# EAGLE design AgitPOV_WiFi (EAGLE 7.4.0)
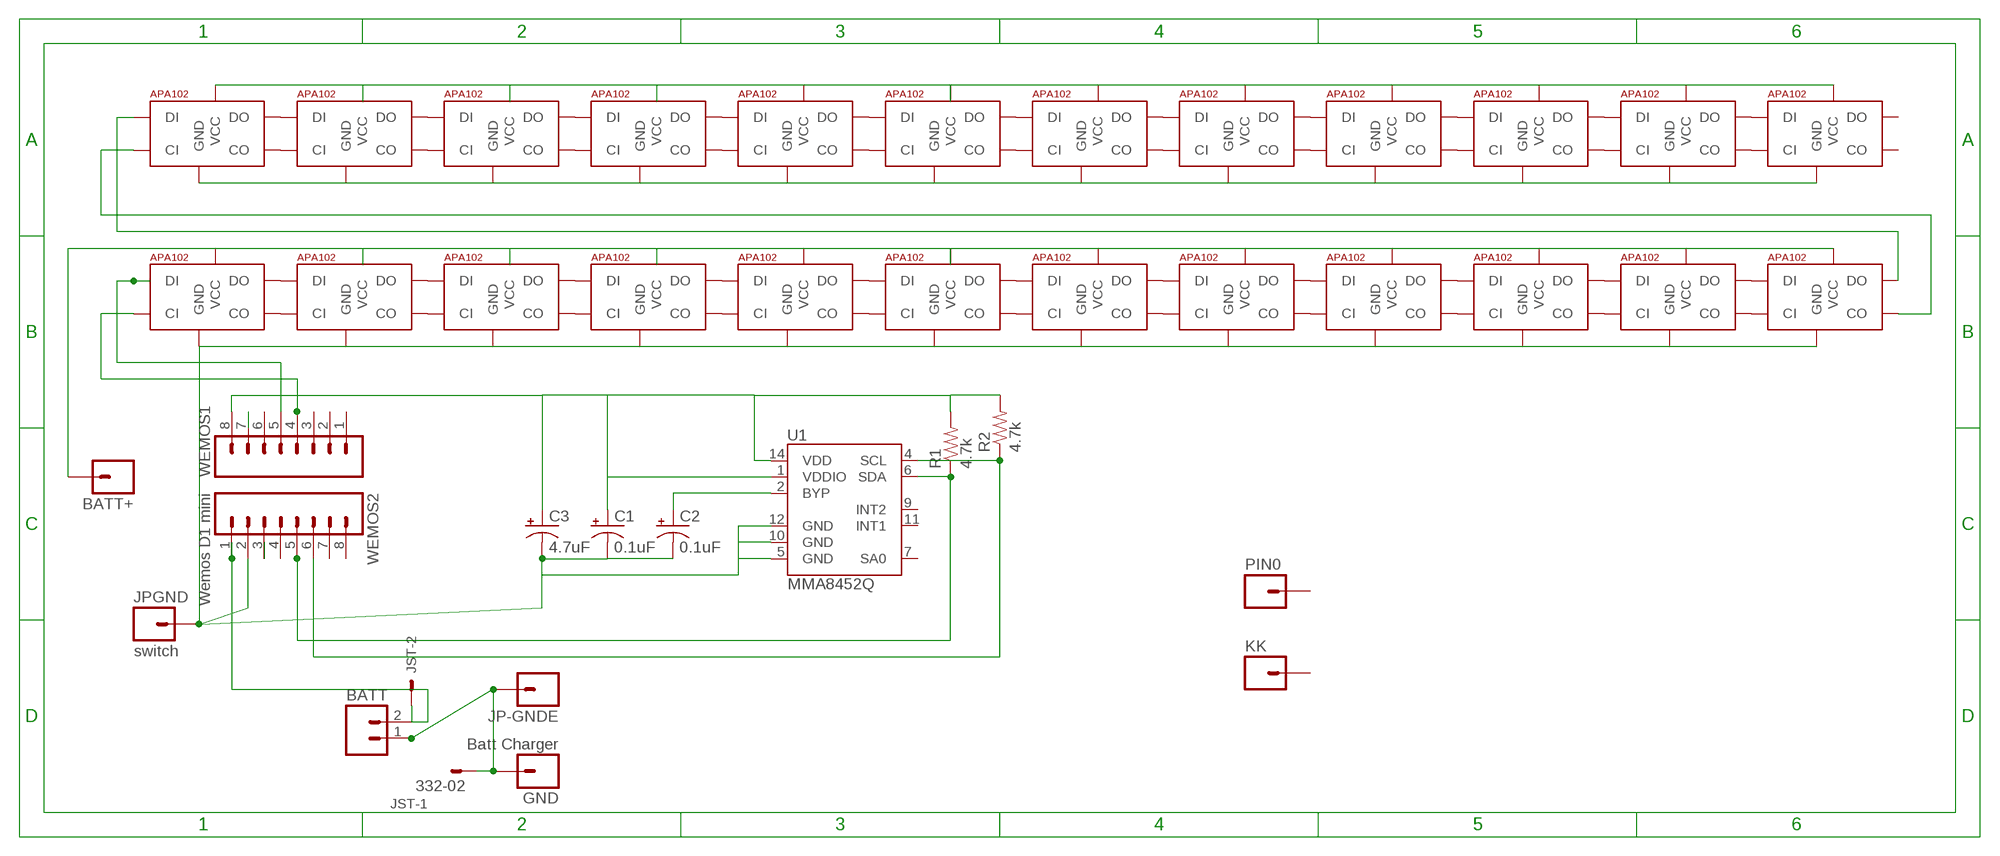
[diagram p0: schematic, sheet 1]

## Parts
BATT  M02LOCK_LONGPADS  [1X02_LOCK_LONGPADS]
BATT+  M01PTH  [1X01]
C1  0.1uF  10UF-16V-10%(TANT)  [EIA3216]
C2  0.1uF  10UF-16V-10%(TANT)  [EIA3216]
C3  4.7uF  10UF-16V-10%(TANT)  [EIA3216]
DEL1  APA1025050  [APA102_5050]
DEL2  APA1025050  [APA102_5050]
DEL3  APA1025050  [APA102_5050]
DEL4  APA1025050  [APA102_5050]
DEL5  APA1025050  [APA102_5050]
DEL6  APA1025050  [APA102_5050]
DEL7  APA1025050  [APA102_5050]
DEL8  APA1025050  [APA102_5050]
DEL9  APA1025050  [APA102_5050]
DEL10  APA1025050  [APA102_5050]
DEL11  APA1025050  [APA102_5050]
DEL12  APA1025050  [APA102_5050]
DEL13  APA1025050  [APA102_5050]
DEL15  APA1025050  [APA102_5050]
DEL16  APA1025050  [APA102_5050]
DEL17  APA1025050  [APA102_5050]
DEL18  APA1025050  [APA102_5050]
DEL19  APA1025050  [APA102_5050]
DEL20  APA1025050  [APA102_5050]
DEL21  APA1025050  [APA102_5050]
DEL22  APA1025050  [APA102_5050]
DEL23  APA1025050  [APA102_5050]
DEL24  APA1025050  [APA102_5050]
FFFFF  APA1025050  [APA102_5050]
GND  Batt Charger  M01PTH  [1X01]
JP-GNDE  M01PTH  [1X01]
JPGND  switch  M01PTH  [1X01]
JST  332-02  [332-02]
KK  M01PTH  [1X01]
PIN0  M01PTH  [1X01]
R1  4.7k  RESISTOR1206  [1206]
R2  4.7k  RESISTOR1206  [1206]
U1  MMA8452Q  [QFN-16_0.5MM]
WEMOS1  M08  [1X08_ROUND]
WEMOS2  Wemos D1 mini  M08  [1X08_ROUND]

## Nets
5V: BATT+.1 BATT.2 DEL1.1(VCC) DEL2.1(VCC) DEL3.1(VCC) DEL4.1(VCC) DEL5.1(VCC) DEL6.1(VCC) DEL7.1(VCC) DEL8.1(VCC) DEL9.1(VCC) DEL10.1(VCC) DEL11.1(VCC) DEL12.1(VCC) DEL13.1(VCC) DEL15.1(VCC) DEL16.1(VCC) DEL17.1(VCC) DEL18.1(VCC) DEL19.1(VCC) DEL20.1(VCC) DEL21.1(VCC) DEL22.1(VCC) DEL23.1(VCC) DEL24.1(VCC) FFFFF.1(VCC) JST.2 WEMOS2.1
+3.3V: C1.A(+) C3.A(+) R1.2 R2.2 U1.1(VDDIO) U1.14(VDD) WEMOS1.8
BYP: C2.A(+) U1.2(BYP)
ENTREEGND: BATT.1 GND.1 JP-GNDE.1 JST.1
GND: C1.C(-) C2.C(-) C3.C(-) DEL1.6(GND) DEL2.6(GND) DEL3.6(GND) DEL4.6(GND) DEL5.6(GND) DEL6.6(GND) DEL7.6(GND) DEL8.6(GND) DEL9.6(GND) DEL10.6(GND) DEL11.6(GND) DEL12.6(GND) DEL13.6(GND) DEL15.6(GND) DEL16.6(GND) DEL17.6(GND) DEL18.6(GND) DEL19.6(GND) DEL20.6(GND) DEL21.6(GND) DEL22.6(GND) DEL23.6(GND) DEL24.6(GND) FFFFF.6(GND) JPGND.1 U1.5(GND) U1.10(GND) U1.12(GND) WEMOS2.2
N$1: WEMOS1.7
N$2: DEL1.5(CI) WEMOS1.4
N$4: DEL1.4(DI) WEMOS1.5
N$8: DEL12.2(CO) DEL13.5(CI)
N$12: DEL2.2(CO) DEL3.5(CI)
N$14: DEL2.3(DO) DEL3.4(DI)
N$15: DEL1.3(DO) DEL2.4(DI)
N$16: DEL1.2(CO) DEL2.5(CI)
N$17: DEL3.3(DO) DEL4.4(DI)
N$18: DEL3.2(CO) DEL4.5(CI)
N$19: DEL4.3(DO) DEL5.4(DI)
N$20: DEL4.2(CO) DEL5.5(CI)
N$21: DEL5.3(DO) DEL6.4(DI)
N$22: DEL5.2(CO) DEL6.5(CI)
N$23: DEL6.3(DO) DEL7.4(DI)
N$24: DEL6.2(CO) DEL7.5(CI)
N$25: DEL7.3(DO) DEL8.4(DI)
N$26: DEL7.2(CO) DEL8.5(CI)
N$27: DEL8.3(DO) DEL9.4(DI)
N$28: DEL8.2(CO) DEL9.5(CI)
N$29: DEL9.3(DO) DEL10.4(DI)
N$30: DEL9.2(CO) DEL10.5(CI)
N$31: DEL10.3(DO) DEL11.4(DI)
N$32: DEL10.2(CO) DEL11.5(CI)
N$33: DEL11.3(DO) DEL12.4(DI)
N$34: DEL11.2(CO) DEL12.5(CI)
N$41: WEMOS2.3
N$42: DEL12.3(DO) DEL13.4(DI)
N$43: DEL15.5(CI) FFFFF.2(CO)
N$44: DEL15.4(DI) FFFFF.3(DO)
N$45: DEL13.3(DO) FFFFF.4(DI)
N$46: DEL13.2(CO) FFFFF.5(CI)
N$47: DEL15.3(DO) DEL16.4(DI)
N$48: DEL15.2(CO) DEL16.5(CI)
N$49: DEL16.3(DO) DEL17.4(DI)
N$50: DEL16.2(CO) DEL17.5(CI)
N$51: DEL17.3(DO) DEL18.4(DI)
N$52: DEL17.2(CO) DEL18.5(CI)
N$53: DEL18.3(DO) DEL19.4(DI)
N$54: DEL18.2(CO) DEL19.5(CI)
N$55: DEL19.3(DO) DEL20.4(DI)
N$56: DEL19.2(CO) DEL20.5(CI)
N$57: DEL20.3(DO) DEL21.4(DI)
N$58: DEL20.2(CO) DEL21.5(CI)
N$59: DEL21.3(DO) DEL22.4(DI)
N$60: DEL21.2(CO) DEL22.5(CI)
N$61: DEL22.3(DO) DEL23.4(DI)
N$62: DEL22.2(CO) DEL23.5(CI)
N$63: DEL23.3(DO) DEL24.4(DI)
N$64: DEL23.2(CO) DEL24.5(CI)
SCL: R2.1 U1.4(SCL) WEMOS2.6
SDA: R1.1 U1.6(SDA) WEMOS2.5
Unconnected: DEL24.2(CO) DEL24.3(DO) KK.1 PIN0.1 U1.7(SA0) U1.9(INT2) U1.11(INT1) WEMOS1.1 WEMOS1.2 WEMOS1.3 WEMOS1.6 WEMOS2.4 WEMOS2.7 WEMOS2.8

## Library data of the parts
BATT = SparkFun-Connectors:M02: Standard 2-pin 0.1" header. Use with - straight break away headers ( PRT-00116) - right angle break away headers (PRT-00553) - swiss pins (PRT-00743) - machine pins (PRT-00117) - female headers (PRT-00115) Molex polarized connector foot print use with: PRT-08233 with associated crimp pins and housings. 2.54_SCREWTERM for use with PRT-10571. 3.5mm Screw Terminal footprints for PRT-08084 5mm Screw Terminal footprints for use with PRT-08432
BATT+ GND JP-GNDE JPGND KK PIN0 = SparkFun-Connectors:M01: Header 1 Standard 1-pin 0.1" header. Use with straight break away headers (SKU : PRT-00116), right angle break away headers (PRT-00553), swiss pins (PRT-00743), machine pins (PRT-00117), and female headers (PRT-00115).
C1-C3 = SparkFun-Capacitors:10UF-16V-10%(TANT): CAP-00811 1206/EIA-3216 Tantalum capacitor; PROD_ID: CAP-00811; VALUE: 10uF
DEL1-DEL13 DEL15-DEL24 FFFFF = jos-ph:APA102: APA102C 5050 RGB LED -- Adafruit DotStar Single LED Pixel Product Page: https://www.adafruit.com/products/2343 Datasheet: https://cdn-shop.adafruit.com/product-files/2343/APA102C.pdf
JST = con-garry:332-02: 2 Pin - 2mm Dual Row Source: www.mpe-connector.de / garry_shortform_2012.pdf
R1 R2 = SparkFun-Resistors:RESISTOR: Resistor Basic schematic elements and footprints for 0603, 1206, and PTH resistors.
U1 = SparkFun-Sensors:MMA8452Q: MMA8452Q 3-Axis, 12/8-bit Digital Accelerometer Supply Voltage: 1.6-3.6V Range: +/- 2g, 4g, 8g Interface: I2C, 12-bit and 8-bit ODR: 1.56 Hz - 800 Hz Package: QFN-16 http://cache.freescale.com/files/sensors/doc/data_sheet/MMA8452Q.pdf; PROD_ID: IC-10769
WEMOS1 WEMOS2 = SparkFun-Connectors:M08: Header 8 Standard 8-pin 0.1" header. Use with straight break away headers (SKU : PRT-00116), right angle break away headers (PRT-00553), swiss pins (PRT-00743), machine pins (PRT-00117), and female headers (PRT-00115).

## Board
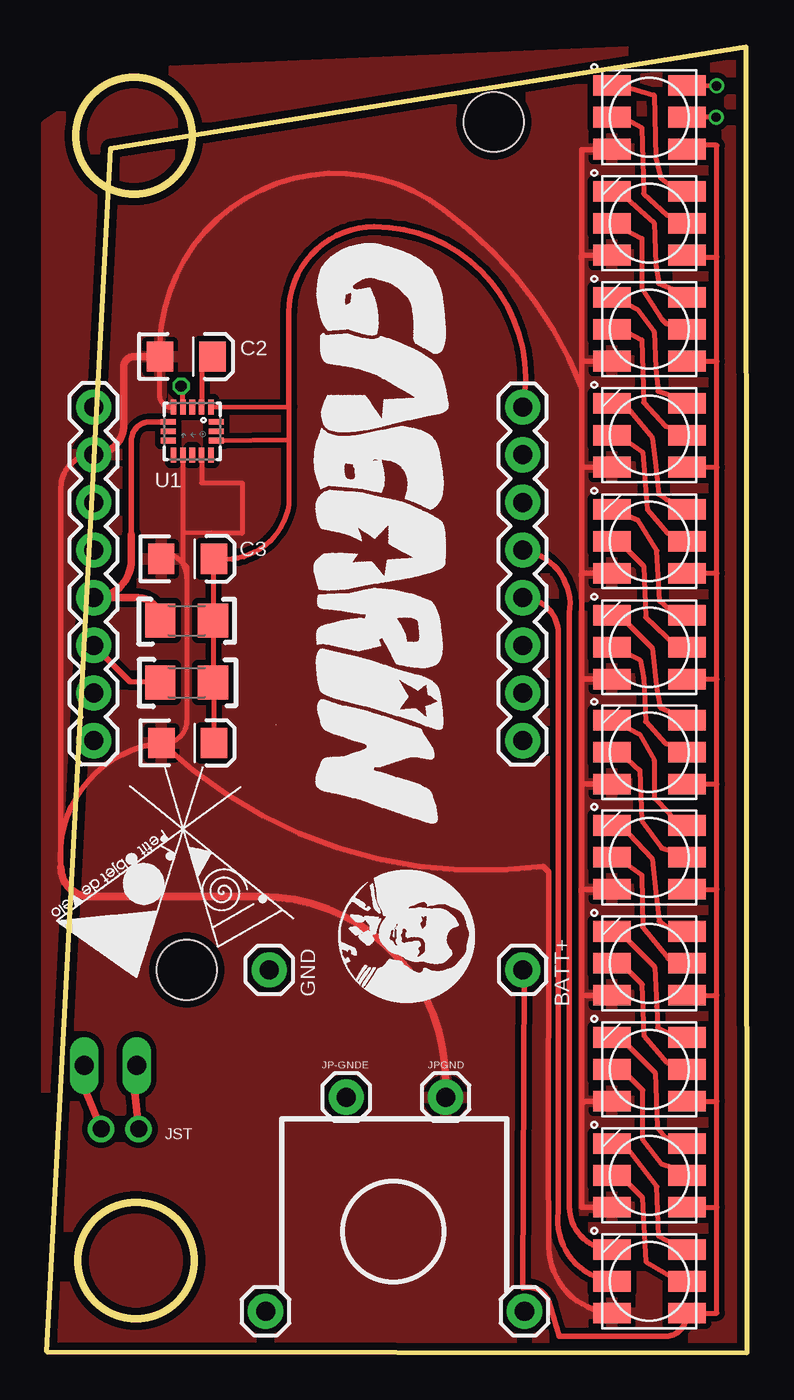
[diagram p1: board, top side]
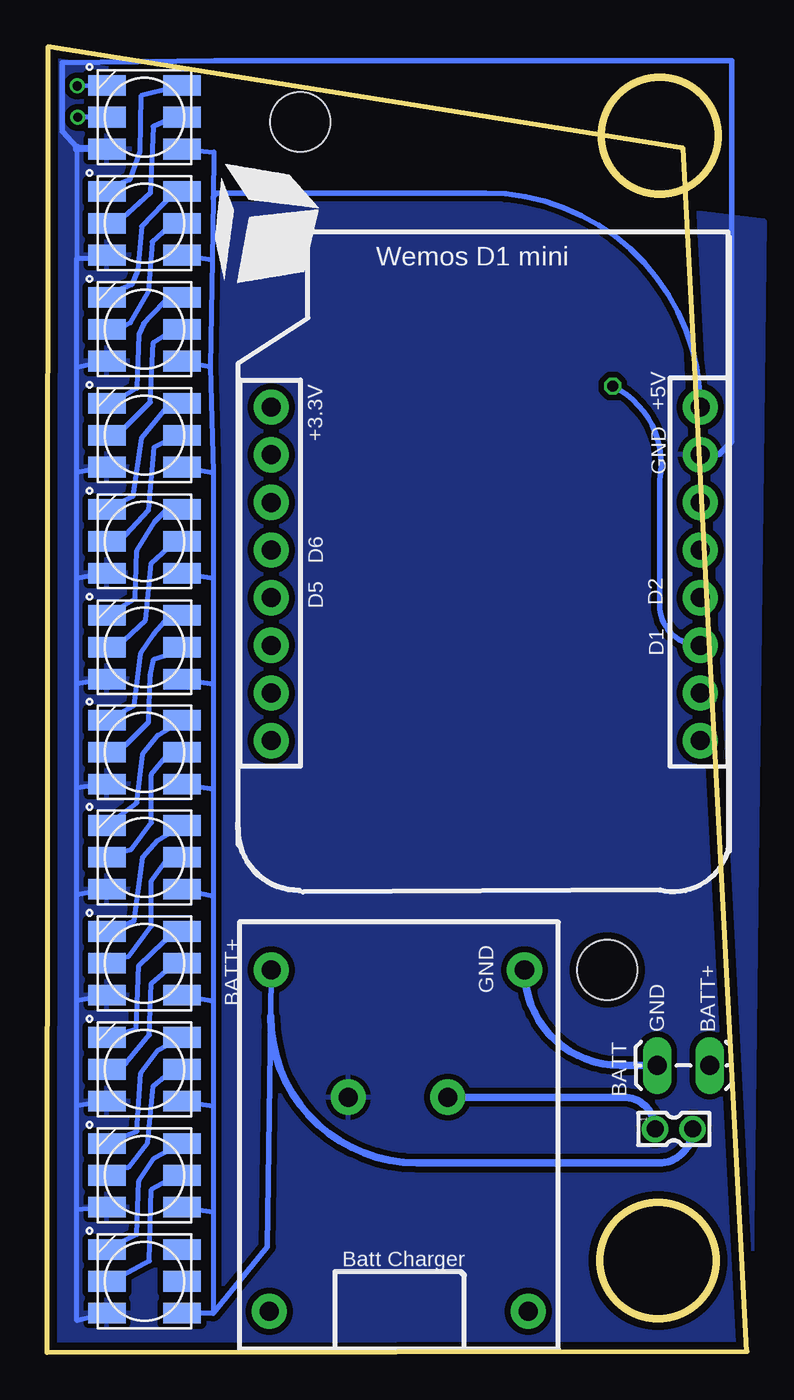
[diagram p2: board, bottom side, seen from below]

Size 37.3 x 69.6 mm. Coordinates in mm from the lower left corner, seen from the top.
Outline: 0,0.05 3.4,64.2 37.25,69.6 37.3,0 0,0.05
Outline: circle at 4.65,64.86 radius 3.09
Outline: circle at 4.75,4.91 radius 3.09
Copper layers (1*16): Top 0.035mm / dielectric 1.5mm / Bottom 0.035mm
Design rules "NOA Eagle Rule 2016-06-12": minimum track width 6mil, minimum drill 0.3mm, track to track 6mil, track to pad 6mil, pad to pad 6mil, via to via 6mil, smd to smd 0mil, copper to edge 0.4mm, drill to drill 10mil, minimum pad ring 10mil, minimum via ring 6mil, stop-mask expansion 2mil, vias tented up to drill 25mil, thermal gap 10mil
Holes 3.2 mm at 23.8,65.6 7.45,20.4

### Footprints (pad centres in the part's own frame; a part is rotated, then mirrored left to right if it is on the bottom)
1X02_LOCK_LONGPADS = drill 1.016 long: 1 -0.127,0; 2 2.667,0
1X01 = drill 1.016 pad 1.88: 1 0,0
EIA3216 = smd 1.4 x 1.6: A 1.4,0; C -1.4,0
APA102_5050 = smd 2 x 1.1: 1 2,-1.7; 2 2,0; 3 2,1.7; 4 -2,1.7; 5 -2,0; 6 -2,-1.7
332-02 = drill 0.9 pad 1.27: 1 0,-1; 2 0,1
1206 = smd 1.6 x 1.8: 1 -1.4,0; 2 1.4,0
QFN-16_0.5MM = smd 0.8 x 0.3: 1 -1.275,1; 2 -1.275,0.5; 3 -1.275,0; 4 -1.275,-0.5; 5 -1.275,-1; 9 1.275,-1; 10 1.275,-0.5; 11 1.275,0; 12 1.275,0.5; 13 1.275,1 | smd 0.3 x 0.8: 6 -0.5,-1.275; 7 0,-1.275; 8 0.5,-1.275; 14 0.5,1.275; 15 0,1.275; 16 -0.5,1.275
1X08_ROUND = drill 1.016 pad 1.88: 1 0,0; 2 2.54,0; 3 5.08,0; 4 7.62,0; 5 10.16,0; 6 12.7,0; 7 15.24,0; 8 17.78,0

### Placement (x,y rotation side)
BATT  4.65,15.3 0 bottom
BATT+  25.35,20.4 0 top
C1  7.5,32.5 0 top
C2  7.42,53.1 0 top
C3  7.5,42.31 0 top
DEL1  32.1,3.8 0 top
DEL2  32.1,9.45 0 top
DEL3  32.1,15.1 0 top
DEL4  32.1,20.75 0 top
DEL5  32.1,26.4 0 top
DEL6  32.1,32 0 top
DEL7  32.1,37.6 0 top
DEL8  32.1,43.25 0 top
DEL9  32.1,48.9 0 top
DEL10  32.1,54.55 0 top
DEL11  32.1,60.2 0 top
DEL12  32.1,65.85 0 top
DEL13  32.1,65.85 0 bottom
DEL15  32.1,54.55 0 bottom
DEL16  32.1,48.9 0 bottom
DEL17  32.1,43.25 0 bottom
DEL18  32.1,37.6 0 bottom
DEL19  32.1,32 0 bottom
DEL20  32.1,26.4 0 bottom
DEL21  32.1,20.75 0 bottom
DEL22  32.1,15.1 0 bottom
DEL23  32.1,9.45 0 bottom
DEL24  32.1,3.8 0 bottom
FFFFF  32.1,60.2 0 bottom
GND  11.85,20.4 0 top
JP-GNDE  15.95,13.61 0 top
JPGND  21.25,13.61 0 top
JST  3.89,11.92 270 bottom
KK  11.65,2.2 0 top
PIN0  25.45,2.2 0 top
R1  7.45,39.02 0 top
R2  7.45,35.72 0 top
U1  7.75,49.11 270 top
WEMOS1  25.35,32.62 90 top
WEMOS2  2.49,50.4 270 top

### Tracks (layer width: path | path; a pad name or v marks a point on that pad's centre or on a via)
5V
  Top 0.254: DEL1.1 35.7,2.1 35.7,7.75 | 35.7,7.75 35.7,13.4 | 35.7,13.4 35.7,19.05 | 35.7,19.05 35.7,24.7 | 35.7,24.7 35.7,30.3 | 35.7,30.3 35.7,35.9 | 35.7,35.9 35.7,41.55 | 35.7,41.55 35.7,47.2 | 35.7,47.2 35.7,52.85 | 35.7,52.85 35.7,58.4 | 35.7,58.4 35.7,64.35 34.1,64.35 DEL12.1 | DEL11.1 34.6,58.5 34.6,58.4 35.7,58.4 | DEL2.1 35.7,7.75 | DEL3.1 35.7,13.4 | DEL4.1 35.7,19.05 | DEL5.1 35.7,24.7 | DEL6.1 35.7,30.3 | DEL7.1 35.7,35.9 | DEL8.1 35.7,41.55 | DEL9.1 35.7,47.2 | DEL10.1 35.7,52.85
  Top 0.305: DEL1.1 arc-90 32.96,0.86 27.3,0.86 26.8,2.56 arc90 25.35,3.46 25.45,20.3 arc90 BATT+.1
  Top 0.406: JST.2 2.08,13.87 BATT.2
  Bottom 0.254: DEL13.1 28.4,64 28.44,61.52 28.5,58.25 | 28.5,58.25 28.6,52.55 | 28.6,52.55 28.45,46.9 | 28.45,46.9 28.45,41.3 | 28.45,41.3 28.45,35.65 | 28.45,35.65 28.45,30.05 | 28.45,30.05 28.45,24.35 | 28.45,24.35 28.45,18.75 | 28.45,18.75 28.45,13.15 | 28.45,13.15 28.45,7.5 | 28.45,7.5 28.45,2.1 DEL24.1 | FFFFF.1 28.5,58.25 | DEL15.1 28.6,52.55 | DEL16.1 28.45,46.9 | DEL17.1 28.45,41.3 | DEL18.1 28.45,35.65 | DEL19.1 28.45,30.05 | DEL20.1 28.45,24.35 | DEL21.1 28.45,18.75 | DEL22.1 28.45,13.15 | DEL23.1 28.45,7.5
  Bottom 0.305: 2.49,50.38 WEMOS2.1 arc-90 13.9,61.81 28.14,61.81 arc-90 28.44,61.52 | 28.45,2.1 25.55,5.65 25.38,17.91 BATT+.1
  Bottom 0.406: 25.38,17.91 arc-90 17.59,10.11 4.7,10.11 arc-90 JST.2
+3.3V
  Top 0.254: C1.A 8.9,35.67 R2.2 R1.2 8.85,42.27 C3.A arc90 12.9,45.21 12.9,48.56 | 12.9,48.56 12.9,50.41 arc90 12.87,50.44 U1.1 | U1.14 12.8,48.66 arc-90 12.9,48.56
  Top 0.305: 12.9,50.41 12.9,55.46 arc-90 17.45,60.01 arc-101 WEMOS1.8
BYP
  Top 0.254: C2.A 8.25,52.52 U1.2
ENTREEGND
  Top 0.406: JST.1 4.68,13.87 BATT.1
  Bottom 0.406: GND.1 arc-90 6.75,15.3 BATT.1 | JST.1 arc-90 6.58,13.61 JP-GNDE.1
GND
  Top 0.254: C3.C 6.1,42.66 arc-90 7.45,41.31 | U1.5 arc-90 6.02,50.91 C2.C | 7.25,46.46 U1.10 7.25,43.71 | 7.45,41.31 7.45,33.66 arc-90 6.28,32.5 C1.C | 7.25,43.71 7.25,42.01 arc-90 7.45,41.81 7.45,41.31 | U1.12 8.25,46.36 10.4,46.36 10.4,43.66 7.25,43.71
  Top 0.305: DEL2.6 28.5,7.75 28.5,13.16 | 28.5,13.16 28.49,19.03 | 28.49,19.03 28.5,19.16 28.5,24.56 | 28.5,24.56 28.5,30.16 | 28.5,30.16 28.5,36.06 | 28.5,36.06 28.5,41.41 | 28.5,41.41 28.5,47.46 28.49,47.64 | 28.49,47.64 28.49,51.41 | 28.49,51.41 28.5,52.76 28.5,52.85 | 28.5,52.85 28.5,58.31 | 28.5,58.31 28.5,64.11 30.06,64.11 arc90 DEL12.6 | DEL11.6 28.53,58.5 arc90 28.5,58.31 | DEL8.6 28.53,41.55 arc90 28.5,41.41 | DEL7.6 28.71,35.9 arc-90 28.5,36.06 | DEL6.6 28.58,30.3 arc90 28.5,30.16 | DEL5.6 28.48,24.7 arc90 28.5,24.56 | DEL3.6 28.73,13.4 arc90 28.5,13.16 | WEMOS2.2 arc90 0.75,46.11 0.75,25.85 arc-90 C1.C arc51 26.45,25.91 26.75,25.61 26.75,18.91 arc1 26.75,5.95 arc90 DEL1.6 | DEL9.6 28.49,47.2 28.49,47.64 | DEL10.6 28.5,52.85 | DEL4.6 28.49,19.05 28.49,19.03 | C2.C 6.02,53.79 arc-126 21.15,60.91 arc-33 28.49,51.41
  Top 0.406: C2.C 4.65,53.1 arc90 4.1,52.54 4.1,49.46 arc-90 WEMOS2.2 | 0.75,25.85 arc90 2.28,24.31 11.4,24.31 arc-90 21.25,14.46 JPGND.1
  Bottom 0.254: DEL24.6 35.7,1.7 35.7,7.6 | 35.7,7.6 35.7,13.15 | 35.7,13.15 35.7,18.75 | 35.7,18.75 35.7,24.4 | 35.7,24.4 35.7,30.1 | 35.7,30.1 35.7,35.65 | 35.7,35.65 35.7,41.25 | 35.7,41.25 35.7,46.9 | 35.7,46.9 35.7,52.5 | 35.7,52.5 35.7,58.35 | 35.7,64.15 35.7,64.25 34.7,64.25 34.7,64.15 | 35.68,64.15 35.7,64.15 | 35.7,64.15 35.7,58.35 | 35.7,58.35 34.8,58.35 | 34.8,58.35 34.8,58.5 34.7,58.5 34.7,58.3 | DEL15.6 35.7,52.5 | DEL16.6 35.7,46.9 | DEL17.6 35.7,41.25 | DEL18.6 35.7,35.65 | DEL19.6 35.7,30.1 | DEL20.6 35.7,24.4 | DEL21.6 35.7,18.75 | DEL22.6 35.7,13.15 | DEL23.6 35.7,7.6 | FFFFF.6 34.23,58.61 34.69,58.61 34.8,58.35
  Bottom 0.305: DEL13.6 35.68,64.15 | 35.7,64.26 36.5,65.11 36.5,68.76 28.35,68.86 0.8,68.86 0.8,48.56 1.5,47.86 WEMOS2.2
  Bottom 0.406: 35.7,64.26 35.7,64.15 | 1.95,47.86 WEMOS2.2
  pour Top (isolate 0.305): 4.05,68.2 37.35,69.6 37.4,0.05 0,0.05 0,65.45
  pour Bottom (isolate 0.305): 9.4,61.55 37.35,69.65 37.4,58.35 37.25,0 -0.2,0.05 -0.95,60.3
N$2
  Top 0.305: WEMOS1.4 arc-90 27.25,38.34 27.25,7.5 arc90 DEL1.5
N$4
  Top 0.305: WEMOS1.5 arc-90 27.85,39.43 27.85,7.75 arc90 DEL1.4
N$8  (via drill 0.5 pad 0.25)
  Top 0.254: v35.66,65.85 DEL12.2
  Bottom 0.254: DEL12.2 v35.66,65.85
N$12
  Top 0.254: DEL3.5 30.13,14.92 30.81,14.92 31.75,13.98 31.75,11.34 32.76,10.04 34.01,9.64 DEL2.2
N$14
  Top 0.254: DEL2.3 34.01,11.24 33.9,11.16 32.92,11.51 32.51,12.02 32.41,14.92 30.58,16.75 30.13,16.75 DEL3.4
N$15
  Top 0.254: DEL1.3 33.9,5.5 32.6,6.2 32.5,8.85 30.9,10.95 30.3,10.95 DEL2.4
N$16
  Top 0.254: DEL2.5 30.13,9.41 30.58,9.41 31.74,8.26 31.94,4.82 33.88,3.68 DEL1.2
N$17
  Top 0.254: DEL3.3 34.01,16.98 33.63,16.77 32.55,17.32 32.48,18.43 32.38,20.56 30.58,22.36 30.13,22.36 DEL4.4
N$18
  Top 0.254: DEL4.5 30.13,20.53 30.81,20.53 31.73,19.62 31.83,16.88 33.06,15.45 DEL3.2
  Top 0.305: DEL3.2 33.6,15.1
N$19
  Top 0.254: DEL4.3 34.01,22.59 33.6,22.3 32.62,23 32.45,24.57 32.25,26.32 30.58,28.1 30.13,28.1 DEL5.4
N$20
  Top 0.254: DEL4.2 34.01,20.76 33.11,21.01 31.75,22.67 31.7,25.45 30.58,26.27 30.13,26.27 DEL5.5
N$21
  Top 0.254: DEL5.3 34.01,28.32 33.33,28.31 33.2,28.71 32.35,29.55 32.35,31.58 31.58,32.95 31.03,33.25 DEL6.4
N$22
  Top 0.254: DEL5.2 34.01,26.5 32.76,26.9 31.7,28.35 31.6,31.04 30.58,31.95 30.13,31.95 DEL6.5
N$23
  Top 0.254: DEL6.3 34.01,33.78 33.6,34 32.67,34.4 32.5,35.36 32.25,37.57 30.58,39.24 30.13,39.24 DEL7.4
N$24
  Top 0.254: DEL6.2 34.01,32.18 32.96,32.48 31.9,33.64 31.8,35.93 31.61,36.91 31.03,37.21 DEL7.5
N$25
  Top 0.254: DEL7.3 33.5,39.3 32.65,40.05 32.5,42.75 31.5,44.35 DEL8.4
N$26
  Top 0.254: DEL7.2 34.01,37.64 33.56,37.64 31.9,39.2 31.8,41.93 30.38,43.35 29.93,43.35 DEL8.5
N$27
  Top 0.254: DEL8.3 33.81,45.18 33.03,45.46 32.6,45.76 32.45,47.25 32.25,48.78 31.18,50.06 31.13,50.16 DEL9.4
N$28
  Top 0.254: DEL8.2 33.81,43.58 33.06,43.68 32,44.93 31.75,47.99 30.38,48.96 29.93,48.96 DEL9.5
N$29
  Top 0.254: DEL9.3 33.81,50.78 33.6,50.9 32.57,51.25 32.45,52.46 32.35,54.42 31.48,55.59 30.93,55.89 DEL10.4
N$30
  Top 0.254: DEL9.2 33.81,49.18 32.96,49.38 31.8,50.64 31.7,53.98 30.61,54.56 29.93,54.56 DEL10.5
N$31
  Top 0.254: DEL10.3 33.81,56.62 33.53,56.61 32.6,57.01 32.45,58 32.35,60.23 30.38,62 29.93,62 DEL11.4
N$32
  Top 0.254: DEL10.2 33.01,54.84 32.76,55.09 31.7,56.75 31.7,59.38 30.68,59.9 29.93,60.4 DEL11.5
N$33
  Top 0.254: DEL11.3 33.81,62.23 33.33,62.11 32.7,62.61 32.45,63.71 32.35,67.04 30.38,67.61 29.93,67.61 DEL12.4
N$34
  Top 0.254: DEL11.2 33.81,60.63 33.06,60.63 31.8,61.79 31.7,65.29 30.38,66.01 29.93,66.01 DEL12.5
N$42  (via drill 0.5 pad 0.25)
  Top 0.254: DEL12.3 v35.68,67.53
  Bottom 0.254: v35.68,67.53 DEL12.3
N$43
  Bottom 0.254: DEL15.5 33.2,54.7 32.85,54.9 31.89,56.56 31.69,59.19 30.8,59.98 30.12,59.98 FFFFF.2
N$44
  Bottom 0.254: DEL15.4 34,56.43 33.02,56.81 32.79,56.91 32.45,57.71 32.25,60.04 30.58,61.81 30.12,61.81 FFFFF.3
N$45
  Bottom 0.254: FFFFF.4 34,62.04 33.12,62.42 32.89,62.52 32.35,64.02 32.3,66.99 30.58,67.42 30.12,67.42 DEL13.3
N$46
  Bottom 0.254: FFFFF.5 34,60.21 33.55,60.21 31.79,61.82 31.64,65.35 30.58,65.82 30.12,65.82 DEL13.2
N$47
  Bottom 0.254: DEL15.3 30.8,56.25 31.9,55.15 32.15,54.85 32.4,54.25 32.5,51.4 33.96,50.52 | 33.96,50.52 34,50.5 | DEL16.4 34,50.59 33.96,50.52
N$48
  Bottom 0.254: DEL15.2 30.12,54.37 30.8,54.37 31.63,53.84 31.78,50.66 33.2,49.24 34,48.99 DEL16.5
N$49
  Bottom 0.254: DEL17.4 32.7,45.65 32.25,48.75 31.05,50.2 30.84,50.58 | 30.84,50.58 30.7,50.3 | DEL16.3 30.12,50.59 30.8,50.59 30.84,50.58
N$50
  Bottom 0.254: DEL16.2 30.12,48.76 30.58,48.76 31.58,48.26 31.88,44.9 33.1,43.58 34,43.38 DEL17.5
N$51
  Bottom 0.254: DEL18.4 32.6,40.2 32.5,42.75 31.55,44.3 30.7,45.15 DEL17.3
N$52
  Bottom 0.254: DEL17.2 30.12,43.16 30.58,43.16 31.73,42.1 32.03,39.06 33.55,37.65 34,37.65 DEL18.5
N$53
  Bottom 0.254: DEL19.4 32.65,34.5 32.3,37.3 31.6,38.3 31,39 DEL18.3
N$54
  Bottom 0.254: DEL18.2 30.12,37.42 31.6,36.97 31.78,36.09 31.88,33.6 33.1,32.39 34,32.09 DEL19.5
N$55
  Bottom 0.254: DEL20.4 32.5,29.3 32.2,31.9 31.4,32.9 DEL19.3
N$56
  Bottom 0.254: DEL19.2 30.12,31.86 30.98,31.76 31.73,30.8 31.73,28.25 32.8,26.83 34,26.53 DEL20.5
N$57
  Bottom 0.254: DEL21.4 32.65,23 32.2,26.4 31.4,27.3 DEL20.3
N$58
  Bottom 0.254: DEL20.2 30.12,26.3 30.88,26.3 31.73,25.15 31.73,22.74 32.95,21.12 34,20.92 DEL21.5
N$59
  Bottom 0.254: DEL22.4 32.55,17.25 32.4,20.65 31.1,21.9 DEL21.3
N$60
  Bottom 0.254: DEL21.2 30.12,20.7 30.58,20.7 31.73,19.69 31.83,16.93 33.1,15.42 33.3,15.52 DEL22.5
N$61
  Bottom 0.254: DEL23.4 32.5,11.8 32.3,14.9 31.4,16.1 DEL22.3
N$62
  Bottom 0.254: DEL22.2 30.12,15.09 30.58,15.09 31.63,14.23 31.93,11.19 32.95,9.88 33.4,9.88 DEL23.5
N$63
  Bottom 0.254: DEL24.4 32.5,6.3 32.4,9.15 31.6,10.35 DEL23.3
N$64
  Bottom 0.254: DEL23.2 30.12,9.35 30.58,9.35 31.73,8.69 31.83,4.89 33.55,3.97 34,3.97 DEL24.5
SCL  (via drill 0.6)
  Top 0.254: U1.4 7.25,51.41 arc90 v7.15,51.51
  Top 0.305: R2.1 4.42,35.77 WEMOS2.6
  Bottom 0.305: WEMOS2.6 arc90 4.65,39.85 4.65,46.51 arc-75 v7.15,51.51
SDA
  Top 0.305: 4.5,43.61 4.5,48.61 arc-90 5.5,49.61 U1.6
  Top 0.406: 4.5,43.61 4.5,42.24 arc-90 WEMOS2.5 4.83,40.24 arc-90 R1.1

### Text on the board
bNames: +5V | +3.3V | GND | D6 | D2 | D5 | D1 | BATT+ | GND | BATT+ | GND
tValues: R2 | R1 | C1
uqam: v0.2
noms_b: V+ | 3V3 | G | D4 | D7 | D2 | A0
192bmp: /Users/uqam/Desktop/ohanda_logo.bmp
noms_t: G | DHT11 | D7 | SPKR | 3V | A0 | D2 | G | DEL | V+ | D2 | A0 | D4 | D7 | G | G | V+ | 3V3 | V+ | MQ-7 | V+ | PWR | G
225bmp: /Users/uqam/Documents/AgitPOV_WiFi/logo_texte_gagarin.bmp